# Altium schematic sheet 24VoltRegulator.SchDoc
size A
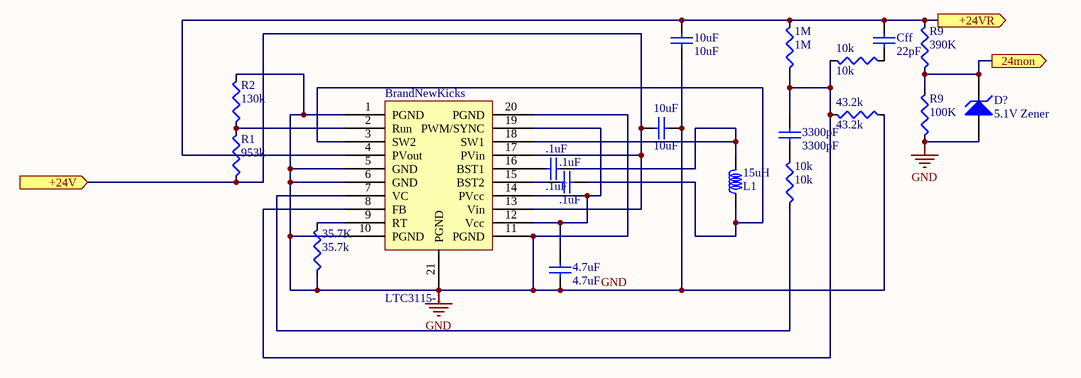
[diagram p0: 24VoltRegulator.SchDoc]

## Parts
(Parts that share a designator on the sheet are numbered #1, #2 ... from top to bottom, then left to right.)
1M  1M  [R 0805 (2012) RESISTOR]
4.7uF  4.7uF  [0805 (2012) Capacitor]
10k#1  10k  [R 0805 (2012) RESISTOR]
10k#2  10k  [R 0805 (2012) RESISTOR]
10uF#1  10uF  [0805 (2012) Capacitor]
10uF#2  10uF  [0805 (2012) Capacitor]
15uH  L1  [WurstInductor]
35.7K  35.7k  [R 0805 (2012) RESISTOR]
43.2k  43.2k  [R 0805 (2012) RESISTOR]
3300pF  3300pF  [0805 (2012) Capacitor]
.1uF#1  .1uF  [0402 (1005) CAPACITOR]
.1uF#2  .1uF  [0402 (1005) CAPACITOR]
BrandNewKicks  LTC3115-1  [LTC3115-1]
Cff  22pF  [0805 (2012) Capacitor]
D?  5.1V Zener  [DIODE-0.7]
R1  953k  [R 0805 (2012) RESISTOR]
R2  130k  [R 0805 (2012) RESISTOR]
R9#1  390K  [R 0805 (2012) RESISTOR]
R9#2  100K  [R 0805 (2012) RESISTOR]

## Ports
24mon (out), +24V (in), +24VR (out)

## Nets
GND: 4.7uF.2 10uF#1.2 10uF#2.1 35.7K.1 43.2k.1 BrandNewKicks.1(PGND) BrandNewKicks.5(GND) BrandNewKicks.6(GND) BrandNewKicks.10(PGND) BrandNewKicks.11(PGND) BrandNewKicks.20(PGND) BrandNewKicks.21(PGND) D?.1(A) R2.2 R9#2.1
24mon: D?.2(K) R9#1.2 R9#2.2 ; port 24mon
+24V: 10uF#2.2 BrandNewKicks.13(Vin) BrandNewKicks.17(PVin) R1.1 ; port +24V
+24VR: 1M.2 10uF#1.1 BrandNewKicks.4(PVout) Cff.1 R9#1.1 ; port +24VR
Net1M_1: 1M.1 10k#1.2 43.2k.2 3300pF.1 BrandNewKicks.8(FB)
Net4.7uF_1: 4.7uF.1 BrandNewKicks.12(Vcc) BrandNewKicks.14(PVcc) BrandNewKicks.19(PWM/SYNC)
Net10k#1_1: 10k#1.1 Cff.2
Net10k#2_1: 10k#2.1 BrandNewKicks.7(VC)
Net10k#2_2: 10k#2.2 3300pF.2
Net15uH_1: 15uH.1 .1uF#2.1 BrandNewKicks.3(SW2)
Net15uH_2: 15uH.2 .1uF#1.1 BrandNewKicks.18(SW1)
Net35.7K_2: 35.7K.2 BrandNewKicks.9(RT)
Net.1uF#1_2: .1uF#1.2 BrandNewKicks.16(BST1)
Net.1uF#2_2: .1uF#2.2 BrandNewKicks.15(BST2)
NetBrandNewKicks_2: BrandNewKicks.2(Run) R1.2 R2.1

## Library data of the parts
1M 10k#1 10k#2 35.7K 43.2k R1 R2 R9#1 R9#2 = Resistor: Value: 0Ohm
4.7uF 10uF#1 10uF#2 3300pF Cff = Capacitor (non-polarized): Capacitor; Value: .1uF
15uH = Inductor
.1uF#1 .1uF#2 = Capacitor (non-polarized): Capacitor; Value: .1uF
D? = D Zener: Zener Diode; Published: 8-Jun-2000; LatestRevisionDate: 17-Jul-2002; LatestRevisionNote: Re-released for DXP Platform.; PackageReference: DIODE-0.7; Publisher: Altium Limited; PackageDescription: Diode, Thru-Hole; 2 Leads; 0.7 in Pin Spacing